# Altium schematic sheet Sheet3.SchDoc
size B
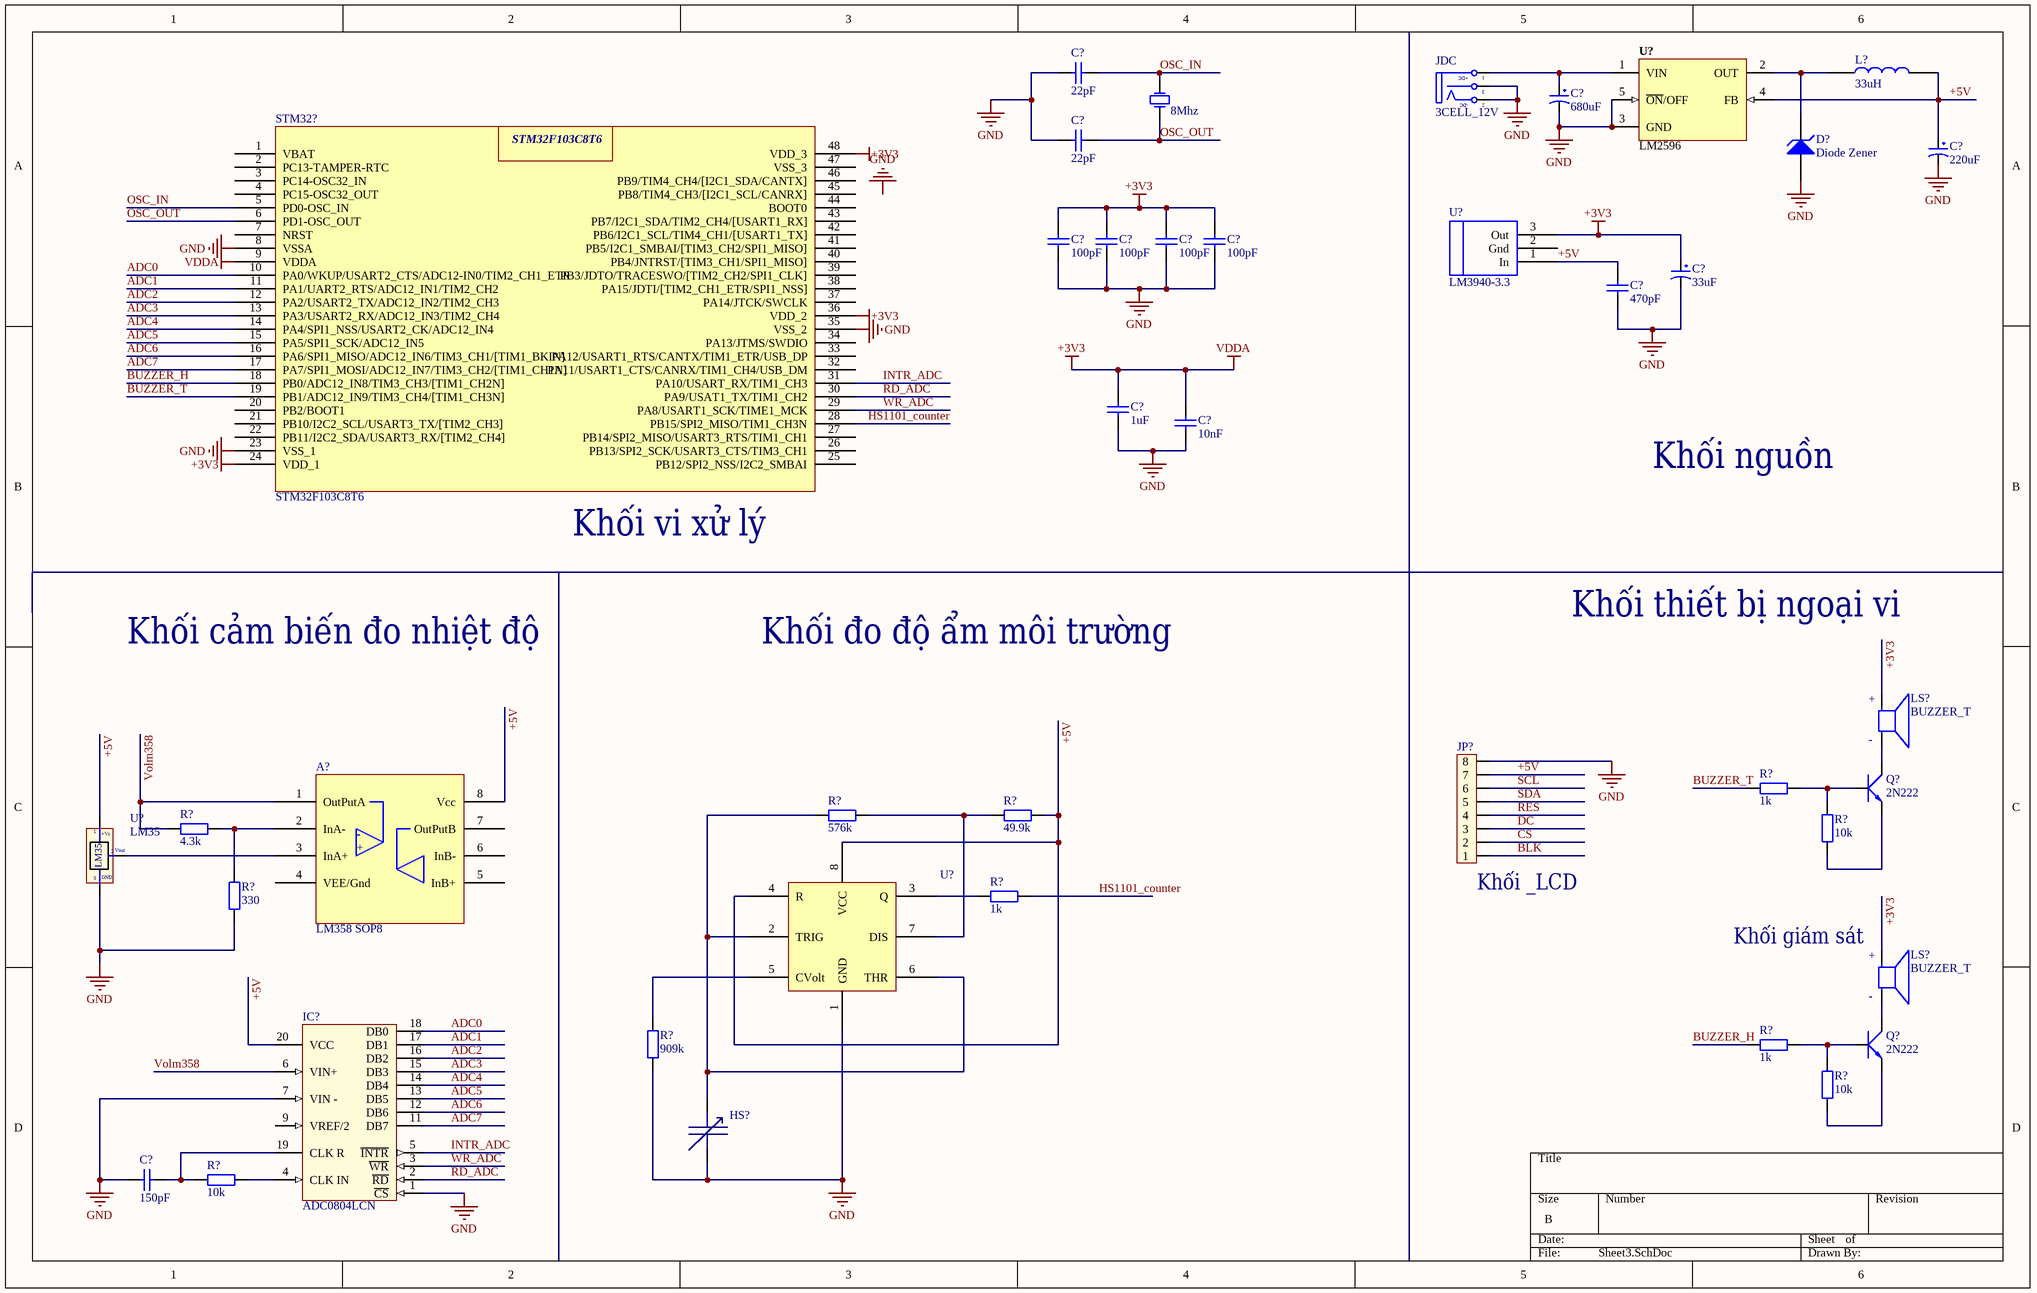
[diagram p0: Sheet3.SchDoc]

## Parts
(Parts that share a designator on the sheet are numbered #1, #2 ... from top to bottom, then left to right.)
A?  LM358 SOP8  [DIP8]
C?#1  22pF  [tu 0805]
C?#2  680uF  [tu hoa 13mm]
C?#3  22pF  [tu 0805]
C?#4  220uF  [Tu hoa 5mm]
C?#5  100pF  [Tu 0805]
C?#6  100pF  [Tu 0805]
C?#7  100pF  [Tu 0805]
C?#8  100pF  [Tu 0805]
C?#9  33uF  [tu hoa 5mm]
C?#10  470pF  [tu 0805]
C?#11  1uF  [tu 0805]
C?#12  10nF  [tu 0805]
C?#13  150pF  [tu 0805]
D?  Diode Zener  [DIODE/NOM/0.5A]
HS?  C1815 SOT23 TRANS NPN 0.15A 50V (SMD-HF)  [Cam Bien HS1101]  (value not drawn)
IC?  ADC0804LCN  [DIP20/W0.3]
JDC  3CELL_12V  [DC-IN]
JP?  LCD ST7735  [JP8]  (value not drawn)
L?  33uH  [Cuon Cam 7.5x7x5]
LS?#1  BUZZER_T  [XDCR_AI-1224-TWT-5V-R]
LS?#2  BUZZER_T  [XDCR_AI-1224-TWT-5V-R]
Q?#1  2N222  [TO92-123]
Q?#2  2N222  [TO92-123]
R?#1  1k  [tro smd 0805]
R?#2  576k  [Tro SMD 0805]
R?#3  49.9k  [tro smd 0805]
R?#4  4.3k  [tro smd 0805]
R?#5  10k  [tro smd 0805]
R?#6  330  [tro smd 0805]
R?#7  1k  [tro smd 0805]
R?#8  909k  [tro smd 0805]
R?#9  1k  [tro smd 0805]
R?#10  10k  [tro smd 0805]
R?#11  10k  [tro smd 0805]
STM32?  STM32F103C8T6
U?#1  LM2596  [TO263]
U?#2  LM3940-3.3  [SOT223]
U?#3  LM35  [QTO-92]
U?#4  MH001514  [sop 8]  (value not drawn)
Y?  8Mhz  [XT2N]

## Nets
+3V3: C?#5.2 C?#6.2 C?#7.1 C?#8.1 C?#9.1 C?#11.1 C?#12.1 LS?#1.P LS?#2.P STM32?.9(VDDA) STM32?.24(VDD_1) STM32?.36(VDD_2) STM32?.48(VDD_3) U?#2.3(Out)  [also labelled VDDA]
GND: C?#1.2 C?#2.2 C?#3.2 C?#4.2 C?#5.1 C?#6.1 C?#7.2 C?#8.2 C?#9.2 C?#10.2 C?#11.2 C?#12.2 C?#13.2 D?.1(A) HS?.1 IC?.1(~{CS}) IC?.7(VIN_-) IC?.8(AGND) IC?.10(DGND) JDC.2(TN) JDC.3(S) JP?.8 R?#6.1 R?#8.1 STM32?.8(VSSA) STM32?.23(VSS_1) STM32?.35(VSS_2) U?#1.3(GND) U?#1.5(~{ON}/OFF) U?#3.3(-) U?#4.1(GND)
+5V: A?.8(Vcc) C?#4.1 C?#10.1 IC?.20(VCC) JP?.7 L?.2 R?#3.2 U?#1.4(FB) U?#2.1(In) U?#3.1(+Vs) U?#4.4(R) U?#4.8(VCC)
ADC0: IC?.18(DB0) STM32?.10(PA0/WKUP/USART2_CTS/ADC12-IN0/TIM2_CH1_ETR)
ADC1: IC?.17(DB1) STM32?.11(PA1/UART2_RTS/ADC12_IN1/TIM2_CH2)
ADC2: IC?.16(DB2) STM32?.12(PA2/USART2_TX/ADC12_IN2/TIM2_CH3)
ADC3: IC?.15(DB3) STM32?.13(PA3/USART2_RX/ADC12_IN3/TIM2_CH4)
ADC4: IC?.14(DB4) STM32?.14(PA4/SPI1_NSS/USART2_CK/ADC12_IN4)
ADC5: IC?.13(DB5) STM32?.15(PA5/SPI1_SCK/ADC12_IN5)
ADC6: IC?.12(DB6) STM32?.16(PA6/SPI1_MISO/ADC12_IN6/TIM3_CH1/[TIM1_BKIN])
ADC7: IC?.11(DB7) STM32?.17(PA7/SPI1_MOSI/ADC12_IN7/TIM3_CH2/[TIM1_CH1N])
BLK: JP?.1
BUZZER_H: R?#9.1 STM32?.18(PB0/ADC12_IN8/TIM3_CH3/[TIM1_CH2N])
BUZZER_T: R?#1.1 STM32?.19(PB1/ADC12_IN9/TIM3_CH4/[TIM1_CH3N])
CS: JP?.2
DC: JP?.3
HS1101_counter: R?#7.2 STM32?.28(PB15/SPI2_MISO/TIM1_CH3N)
INTR_ADC: IC?.5(~{INTR}) STM32?.31(PA10/USART_RX/TIM1_CH3)
OSC_IN: C?#1.1 STM32?.5(PD0-OSC_IN) Y?.2(OSC2)
OSC_OUT: C?#3.1 STM32?.6(PD1-OSC_OUT) Y?.1(OSC1)
RD_ADC: IC?.2(~{RD}) STM32?.30(PA9/USAT1_TX/TIM1_CH2)
RES: JP?.4
SCL: JP?.6
SDA: JP?.5
Volm358: A?.1(OutPutA) IC?.6(VIN+) R?#4.1
WR_ADC: IC?.3(~{WR}) STM32?.29(PA8/USART1_SCK/TIME1_MCK)
NetA?_2: A?.2(InA-) R?#4.2 R?#6.2
NetA?_3: A?.3(InA+) U?#3.2(Vout)
NetC?#2_1: C?#2.1 JDC.1(T) U?#1.1(VIN)
NetC?#13_1: C?#13.1 IC?.19(CLK_R) R?#11.1
NetD?_2: D?.2(K) L?.1 U?#1.2(OUT)
NetHS?_2: HS?.2 R?#2.1 U?#4.2(TRIG) U?#4.6(THR)
NetIC?_4: IC?.4(CLK_IN) R?#11.2
NetLS?#1_N: LS?#1.N Q?#1.3(C)
NetLS?#2_N: LS?#2.N Q?#2.3(C)
NetQ?#1_1: Q?#1.1(E) R?#5.1
NetQ?#1_2: Q?#1.2(B) R?#1.2 R?#5.2
NetQ?#2_1: Q?#2.1(E) R?#10.1
NetQ?#2_2: Q?#2.2(B) R?#9.2 R?#10.2
NetR?#2_2: R?#2.2 R?#3.1 U?#4.7(DIS)
NetR?#7_1: R?#7.1 U?#4.3(Q)
NetR?#8_2: R?#8.2 U?#4.5(CVolt)

Not connected (* = marked no-connect by the designer): A? 4(VEE/Gnd) 5(InB+) 6(InB-) 7(OutPutB); IC? 9(VREF/2); STM32? 1(VBAT) 2(PC13-TAMPER-RTC) 3(PC14-OSC32_IN) 4(PC15-OSC32_OUT) 7(NRST) 20(PB2/BOOT1) 21(PB10/I2C2_SCL/USART3_TX/[TIM2_CH3]) 22(PB11/I2C2_SDA/USART3_RX/[TIM2_CH4]) 25(PB12/SPI2_NSS/I2C2_SMBAI) 26(PB13/SPI2_SCK/USART3_CTS/TIM3_CH1) 27(PB14/SPI2_MISO/USART3_RTS/TIM1_CH1) 32(PA11/USART1_CTS/CANRX/TIM1_CH4/USB_DM) 33(PA12/USART1_RTS/CANTX/TIM1_ETR/USB_DP) 34(PA13/JTMS/SWDIO) 37(PA14/JTCK/SWCLK) 38(PA15/JDTI/[TIM2_CH1_ETR/SPI1_NSS]) 39(PB3/JDTO/TRACESWO/[TIM2_CH2/SPI1_CLK]) 40(PB4/JNTRST/[TIM3_CH1/SPI1_MISO]) 41(PB5/I2C1_SMBAI/[TIM3_CH2/SPI1_MISO]) 42(PB6/I2C1_SCL/TIM4_CH1/[USART1_TX]) 43(PB7/I2C1_SDA/TIM2_CH4/[USART1_RX]) 44(BOOT0) 45(PB8/TIM4_CH3/[I2C1_SCL/CANRX]) 46(PB9/TIM4_CH4/[I2C1_SDA/CANTX]) 47(VSS_3); U?#2 2(Gnd)

## Notes on the sheet
- Khối nguồn
- (near STM32?) Khối vi xử lý
- Khối thiết bị ngoại vi
- Khối cảm biến đo nhiệt độ
- Khối đo độ ẩm môi trường
- (near JP?) Khối _LCD
- (near LS?#2) Khối giám sát
- Labels drawn without touching a wire or pin: GND
- (in symbol AI-1224-TWT-5V-R) +; -
- (in symbol Jac_DC) +DC; -DC
- (in symbol LM35) GND
- (in symbol LM358) -; +

## Library data of the parts
A? = LM358: Dán; Ma_Hang: MH000609; Don_Vi: Con; Ten_Linh_Kien: LM358 SOP8; Kieu_Chan: *; Ghi_Chu: *; Chung_Loai: Dán
C?#1 C?#3 = Tu 0805 22pF 50V 10%: Dán; Don_Vi: Con; So_Chan: 2; Ten_Linh_Kien: Tụ 0805 22P 10% 50V; Ma_Hang: MH004560; Chung_Loai: Dán; Kieu_Chan: *
C?#2 = Tu Hoa 680uF 25V 13x17: Cắm; Don_Vi: Con; So_Chan: 2; Ten_Linh_Kien: Tụ Hóa 680uF 25V; Ma_Hang: MH005082; Chung_Loai: Cắm; Kieu_Chan: *
C?#4 = Tu Hoa 220uF 16V 6x11: Cắm; Don_Vi: Con; So_Chan: 2; Ten_Linh_Kien: Tụ Hóa 220uF 16V 6x11MM; Ma_Hang: MH001348; Chung_Loai: Cắm; Kieu_Chan: *
C?#5-C?#8 = Tu 0805 200pF 50V 10%: Dán; Ten_Linh_Kien: Tụ 0805 200p 10% 50V; Don_Vi: Con; So_Chan: 2; Ma_Hang: MH008100; Chung_Loai: Dán; Kieu_Chan: *
C?#9 = Tu Hoa 33uF 35V 5x11: Cắm; Don_Vi: Con; So_Chan: 2; Ten_Linh_Kien: Tụ Hóa 33uF 35V; Ma_Hang: MH005647; Chung_Loai: Cắm; Kieu_Chan: *
C?#10-C?#12 = Tu 0805 474 50V 10%: Dán; Don_Vi: Con; So_Chan: 2; Ten_Linh_Kien: Tụ 0805 474-470nF 50V 10%; Ma_Hang: MH006116; Chung_Loai: Dán; Kieu_Chan: *
C?#13 = Tu 0805 220nF 50V 10%: Dán; Don_Vi: Con; So_Chan: 2; Ten_Linh_Kien: Tụ 0805 220nF 50V 10%; Ma_Hang: MH008099; Chung_Loai: Dán; Kieu_Chan: *
D? = Diode Zener: Zener Diode; Published: 8-Jun-2000; LatestRevisionDate: 17-Jul-2002; LatestRevisionNote: Re-released for DXP Platform.; PackageReference: DIODE-0.7; Publisher: Altium Limited
HS? = Cam Bien HS1101: Cắm; Value: Cảm Biến Độ Ẩm HS1101
IC? = ADC0804: Cắm; Ten_Linh_Kien: ADC0804LCN DIP20; Don_Vi: Con; Ma_Hang: MH002626; Ghi_Chu: *; Kieu_Chan: *; Chung_Loai: Cắm
JDC = Jac_DC: Cắm; Ten_Linh_Kien: Jack DC5.5x2.1MM DC5501; Ma_Hang: MH000923; Don_Vi: Con; Kieu_Chan: *; Ghi_Chu: *; Chung_Loai: Cắm
JP? = JP8: JP8 PIN; Value: JP7
L? = CUON CAM 47uH_ SMD: Dán; Don_Vi: Con; Ma_Hang: MH004211; Ten_Linh_Kien: Cuộn Cảm 47uH 7x7x4MM CD74R; Ghi_Chu: *; Kieu_Chan: *; Chung_Loai: Dán
LS?#1 LS?#2 = AI-1224-TWT-5V-R: AUDIO INDICATOR 5VDC 30MA 85DB; MF: PUI Audio, Inc.; MP: AI-1224-TWT-5V-R; SnapEDA_Link: https://www.snapeda.com/parts/AI-1224-TWT-5V-R/PUI%20Audio,%20Inc./view-part/5873694/?ref=snap; Availability: In Stock; Check_prices: https://www.snapeda.com/parts/AI-1224-TWT-5V-R/PUI%20Audio,%20Inc./view-part/5873694/?ref=eda; Value: *; Purchase-URL: https://pricing.snapeda.com/search/part/AI-1224-TWT-5V-R/?ref=eda; Package: PUI Audio, Inc.; Price: None
Q?#1 Q?#2 = 2N222: NPN 600mW, ECB; Value: C1815
R?#1 R?#4 R?#7 R?#9 = Tro 0805 1% 1k: Dán; Don_Vi: Con; So_Chan: 2; Ten_Linh_Kien: Trở 0805 1% 1k; Ma_Hang: MH005468; Chung_Loai: Dán; Kieu_Chan: *
R?#2 = Tro 0805 5% 510k: Dán; Don_Vi: Con; Ma_Hang: MH007566; Ten_Linh_Kien: Trở 0805 5% 510k; So_Chan: 2; Chung_Loai: Dán; Kieu_Chan: *
R?#3 = Tro 0805 1% 49.9k: Dán; Don_Vi: Con; So_Chan: 2; Ten_Linh_Kien: Trở 0805 1% 49.9k; Ma_Hang: MH005479; Chung_Loai: Dán; Kieu_Chan: *
R?#5 R?#10 = Tro 0805 1% 10k: Dán; Don_Vi: Con; So_Chan: 2; Ten_Linh_Kien: Trở 0805 1% 10k; Ma_Hang: MH005473; Chung_Loai: Dán; Kieu_Chan: *
R?#6 = Tro 0805 1% 680R: Dán; Don_Vi: Con; So_Chan: 2; Ten_Linh_Kien: Trở 0805 1% 680R; Ma_Hang: MH005487; Chung_Loai: Dán; Kieu_Chan: *
R?#8 = Tro 0805 5% 1M: Dán; Don_Vi: Con; So_Chan: 2; Ten_Linh_Kien: Trở 0805 5% 1M; Ma_Hang: MH005235; Chung_Loai: Dán; Kieu_Chan: *
R?#11 = Tro 0805 5% 10k: Dán; Don_Vi: Con; So_Chan: 2; Ten_Linh_Kien: Trở 0805 5% 10k; Ma_Hang: MH005239; Chung_Loai: Dán; Kieu_Chan: *
STM32? = STM32F103C8T6: Dán; Ma_Hang: MH000567; Don_Vi: Con; Ten_Linh_Kien: STM32F103C8T6; Kieu_Chan: *; Ghi_Chu: *; Chung_Loai: Dán
U?#1 = LM2596: Max Input Voltage: 12 V; Max Output Current: 3 (6.0 peak) A; Max Output Voltage: mV; Category: IC-Power; Min Input Voltage: mV; Min Output Voltage: mV; Mounting Technology: Surface Mount; Status: Unreleased; Supply Voltage: mV; Temperature Range: -40 to +125 degC
U?#2 = LM3940-3.3-SOT223: 3.3 VOLT LINEAR REGULATOR SOT223; Manufacturer: National Semiconductor; Manufacturer Part Number: LM3940IMP-3.3/NOPB; Number of Regulators: 1; Regulator Topology: Positive Fixed; Voltage - Output: 3.3V; Current - Output: 1A; Voltage - Input: 4.5 ~ 5.5 V; Voltage - Dropout (Typical): 0.11V @ 100mA; Supplier 1: Digi-Key; Supplier Part Number 1: LM3940IMP-3.3DKR-ND; Package / Case: SOT-223 (3 leads + Tab), SC-73, TO-261AA; Operating Temperature: -40°C ~ 125°C; Supplier Part Number: LM3940IMP-3.3DKR-ND; Supplier: Digi-Key; Current - Limit (Min): -; Packaging: Digi-Reel®; RoHS: RoHS Compliant; Category: Integrated Circuits (ICs)
U?#3 = LM35: Teminal; Value: LM35
U?#4 = NE555: Dán; Value: NE555 SOP8
Y? = Thach Anh 8Mhz DIP: Cắm; Don_Vi: Con; Ghi_Chu: *; Ma_Hang: *; Kieu_CHan: *; Chung_Loai: Cắm